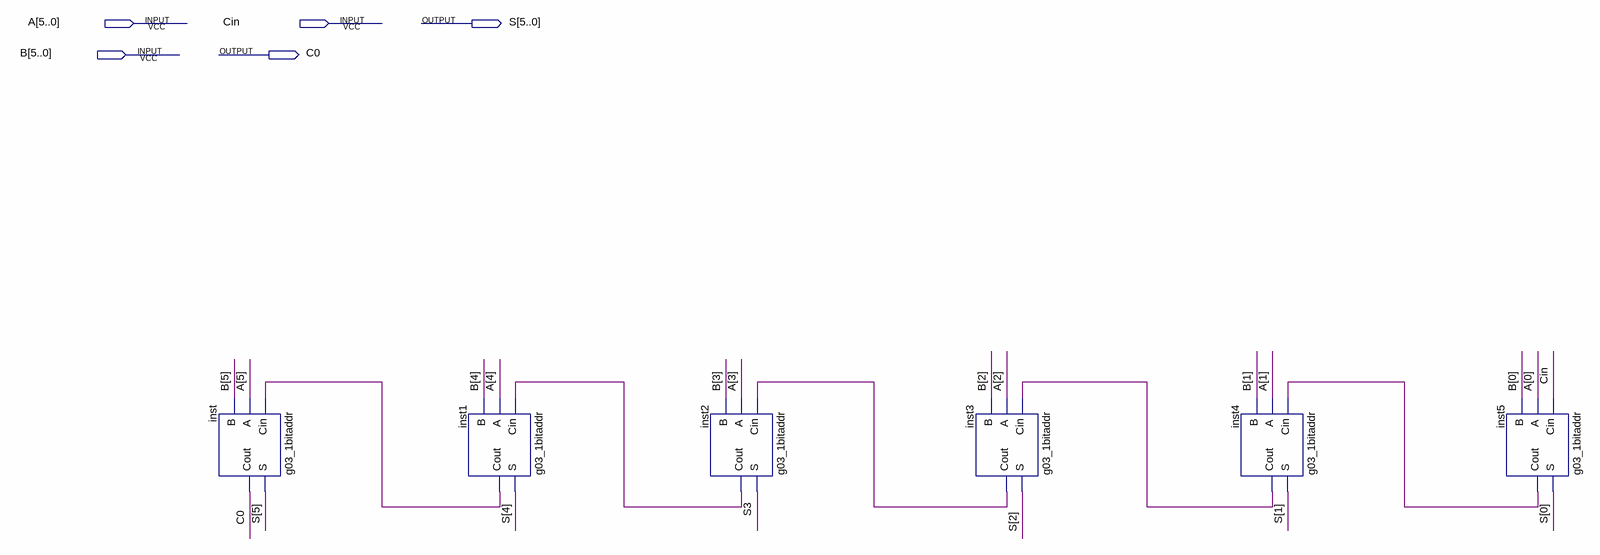
[diagram p0: schematic sheet]
// Quartus schematic g03_6bitaddr.bdf as structural Verilog: 6 symbols, 5 pins
module g03_6bitaddr (
  input  [5:0] A,
  input  Cin,
  input  [5:0] B,
  output [5:0] S,
  output C0
);

  wire inst1_cout, inst2_cout, inst3_cout, inst4_cout, inst5_cout;

  g03_1bitaddr inst (.Cin(inst1_cout), .A(A[5]), .B(B[5]), .S(S[5]), .Cout(C0));
  g03_1bitaddr inst1 (.Cin(inst2_cout), .A(A[4]), .B(B[4]), .S(S[4]), .Cout(inst1_cout));
  g03_1bitaddr inst2 (.Cin(inst3_cout), .A(A[3]), .B(B[3]), .S(S[3]), .Cout(inst2_cout));
  g03_1bitaddr inst3 (.Cin(inst4_cout), .A(A[2]), .B(B[2]), .S(S[2]), .Cout(inst3_cout));
  g03_1bitaddr inst4 (.Cin(inst5_cout), .A(A[1]), .B(B[1]), .S(S[1]), .Cout(inst4_cout));
  g03_1bitaddr inst5 (.Cin(Cin), .A(A[0]), .B(B[0]), .S(S[0]), .Cout(inst5_cout));
endmodule
